# EAGLE board main (EAGLE 7.6.0)
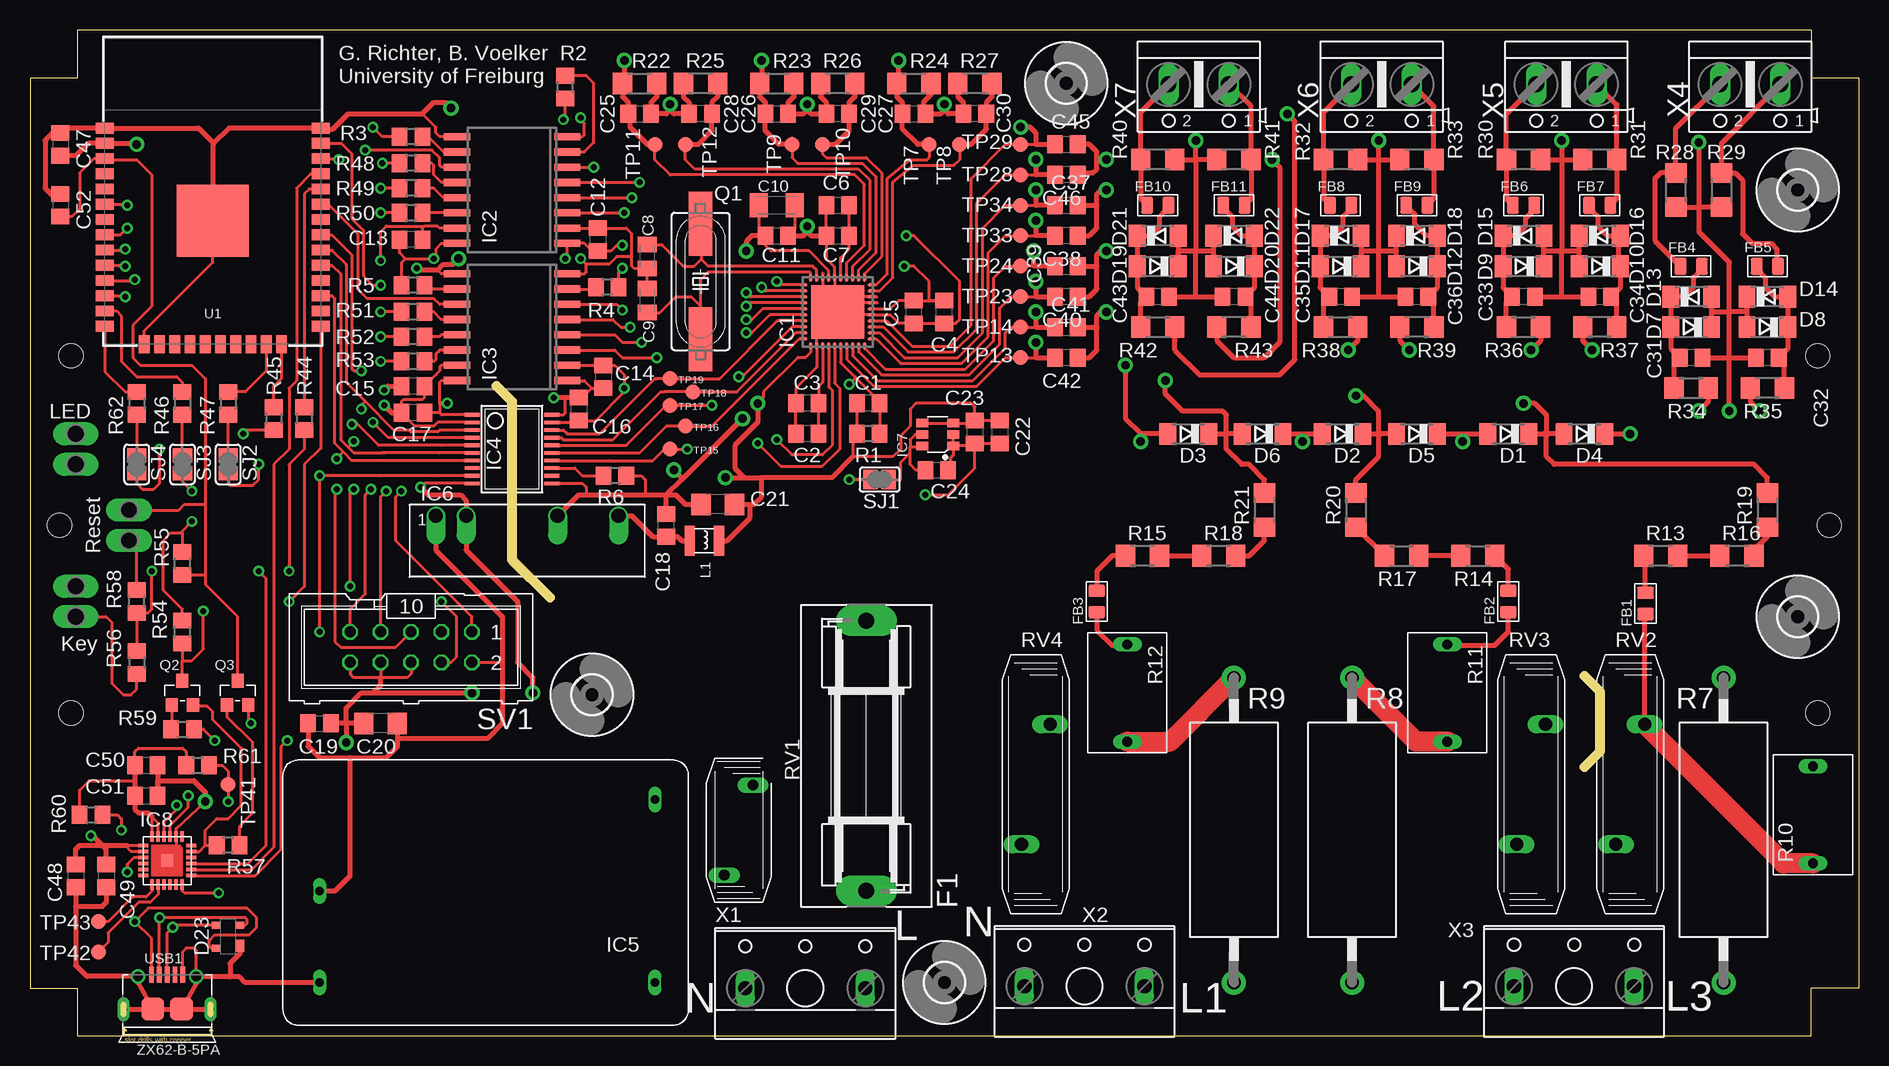
[diagram p7: board, top side]
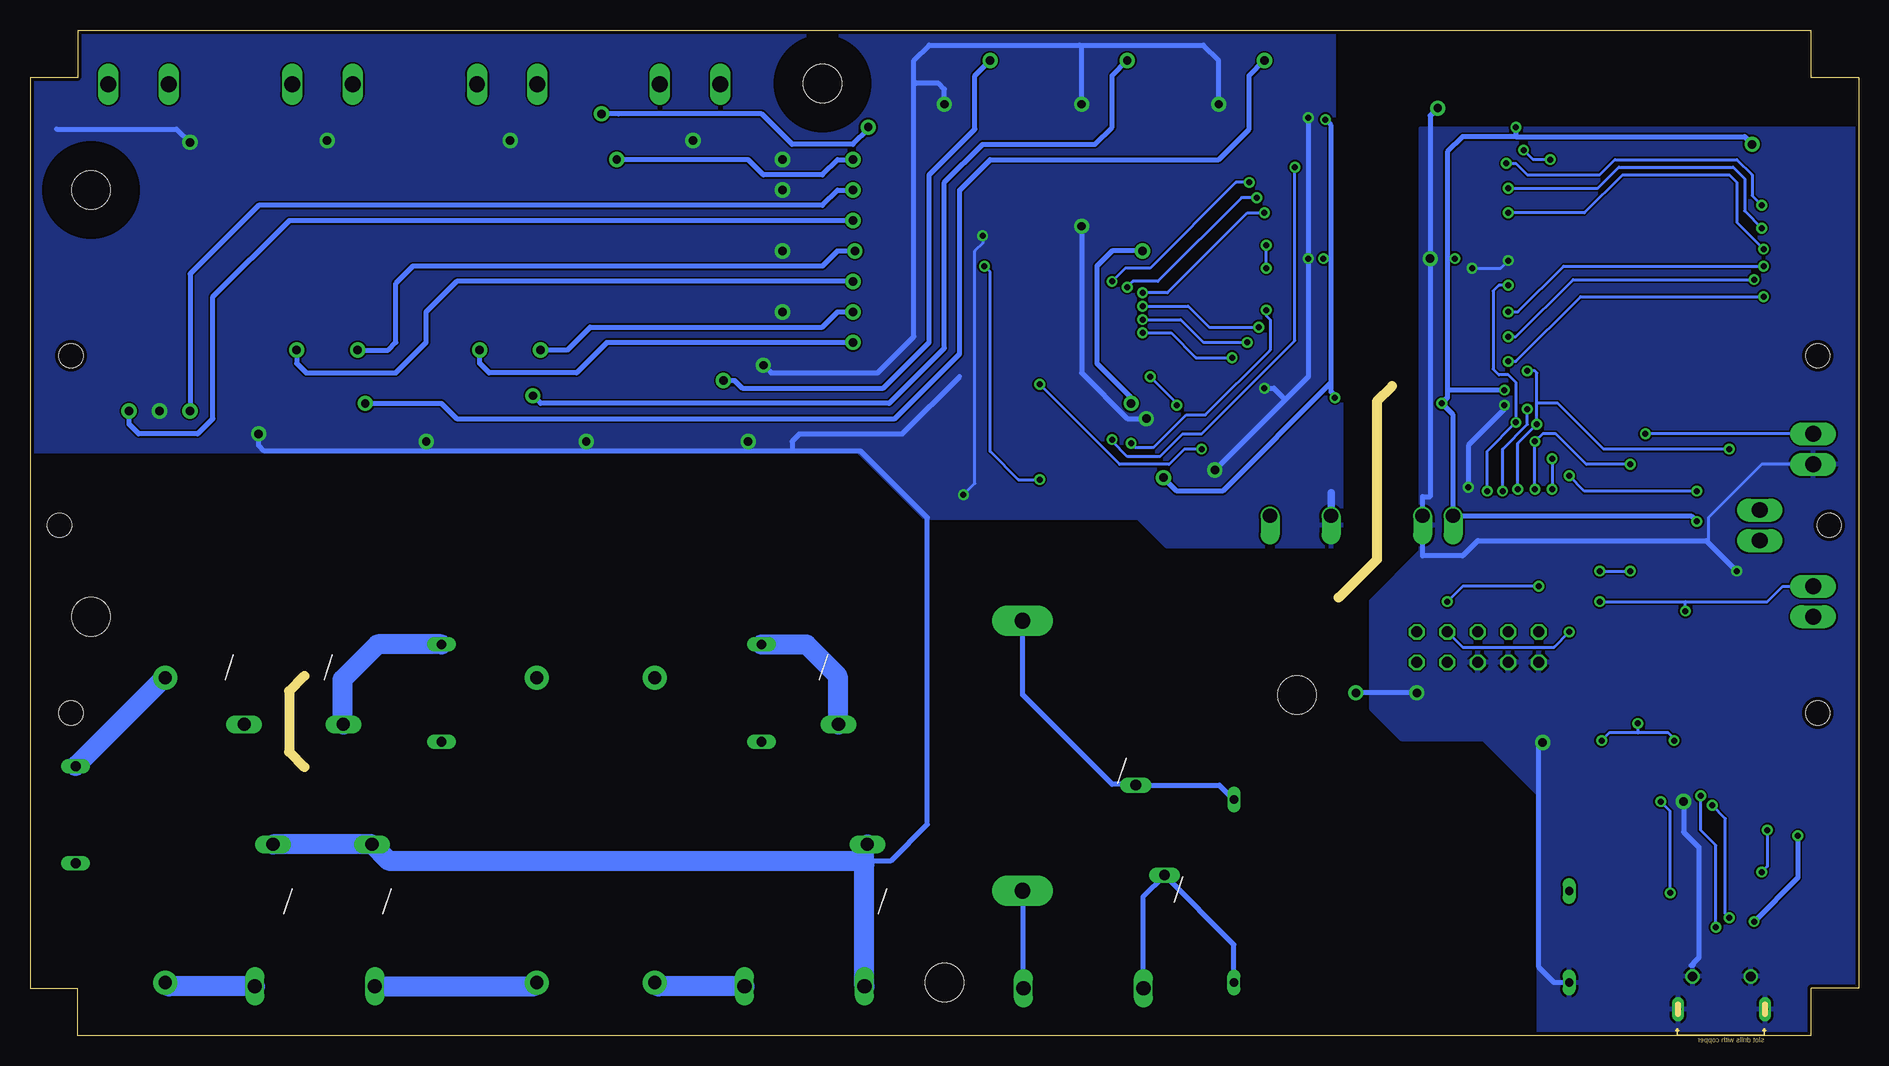
[diagram p8: board, bottom side, seen from below]

Size 152.4 x 83.82 mm. Coordinates in mm from the lower left corner, seen from the top.
Outline: 148.43,83.82 3.97,83.82 3.97,79.85 0,79.85 0,3.97 3.97,3.97 3.97,0 148.43,0 148.43,3.97 152.4,3.97 152.4,79.85 148.43,79.85 148.43,83.82
Copper layers (1*16): Top 0.035mm / dielectric 1.5mm / Bottom 0.035mm
Design rules "PCB-POOL Standard": minimum track width 0.15mm, minimum drill 0.3mm, track to track 0.15mm, track to pad 0.15mm, pad to pad 0.15mm, via to via 0.15mm, smd to smd 0.15mm, copper to edge 0.3mm, drill to drill 0.2mm, minimum pad ring 0.2mm, minimum via ring 0.15mm, stop-mask expansion 0.075mm, vias tented up to drill 0mil, thermal gap 0.2mm
Holes 2 mm at 148.99,56.67 148.99,26.91 3.41,56.67 2.46,42.55 3.41,26.91 149.94,42.55
Milling: 6 lines

## Footprints (pad centres in the part's own frame; a part is rotated, then mirrored left to right if it is on the bottom)
C0805 = smd 1.3 x 1.5: 1 -0.95,0; 2 0.95,0
C0805K = smd 1.3 x 1.6: 1 -1,0; 2 1,0
C1206K = smd 1.5 x 2: 1 -1.5,0; 2 1.5,0
C3216 = smd 1.6 x 1.8: 1 -1.4,0; 2 1.4,0
SOD80C = smd 1.4 x 1.8: A 1.7,0; C -1.7,0
SOT143-4-R = smd 1 x 0.7: 1 -0.75,-1 | smd 0.6 x 0.7: 2 0.95,-1; 3 0.95,1; 4 -0.95,1
SH22,5A = drill 1.321 pad 2.54 long: 1 -11.252,0; 2 11.252,0
L0805 = smd 1.016 x 1.397: 1 -0.889,0; 2 0.889,0
QFN40 = smd 0.65 x 0.25: 1 -2.825,2.25; 2 -2.825,1.75; 3 -2.825,1.25; 4 -2.825,0.75; 5 -2.825,0.25; 6 -2.825,-0.25; 7 -2.825,-0.75; 8 -2.825,-1.25; 9 -2.825,-1.75; 10 -2.825,-2.25; 21 2.825,-2.25; 22 2.825,-1.75; 23 2.825,-1.25; 24 2.825,-0.75; 25 2.825,-0.25; 26 2.825,0.25; 27 2.825,0.75; 28 2.825,1.25; 29 2.825,1.75; 30 2.825,2.25 | smd 0.25 x 0.65: 11 -2.25,-2.825; 12 -1.75,-2.825; 13 -1.25,-2.825; 14 -0.75,-2.825; 15 -0.25,-2.825; 16 0.25,-2.825; 17 0.75,-2.825; 18 1.25,-2.825; 19 1.75,-2.825; 20 2.25,-2.825; 31 2.25,2.825; 32 1.75,2.825; 33 1.25,2.825; 34 0.75,2.825; 35 0.25,2.825; 36 -0.25,2.825; 37 -0.75,2.825; 38 -1.25,2.825; 39 -1.75,2.825; 40 -2.25,2.825 | smd 4.45 x 4.45: EXP 0,0
SO16W = smd 0.6 x 2.2: 1 -4.445,-5.4; 2 -3.175,-5.4; 3 -1.905,-5.4; 4 -0.635,-5.4; 5 0.635,-5.4; 6 1.905,-5.4; 7 3.175,-5.4; 8 4.445,-5.4; 9 4.445,3.8; 10 3.175,3.8; 11 1.905,3.8; 12 0.635,3.8; 13 -0.635,3.8; 14 -1.905,3.8; 15 -3.175,3.8; 16 -4.445,3.8
SSOP20 = smd 0.305 x 1.245: 1 -2.857,-3.302; 2 -2.222,-3.302; 3 -1.587,-3.302; 4 -0.952,-3.302; 5 -0.317,-3.302; 6 0.318,-3.302; 7 0.953,-3.302; 8 1.588,-3.302; 9 2.223,-3.302; 10 2.858,-3.302; 11 2.858,3.302; 12 2.223,3.302; 13 1.588,3.302; 14 0.953,3.302; 15 0.318,3.302; 16 -0.317,3.302; 17 -0.952,3.302; 18 -1.587,3.302; 19 -2.222,3.302; 20 -2.857,3.302
MW_IRM-02 = drill 0.7 long: +V 13.97,0; -V 13.97,7.62; AC/L -13.97,-7.62; AC/N -13.97,7.62
SIP-7PIN-1257 = drill 1.2 offset: 1 -7.62,1.27; 2 -5.08,1.27; 5 2.54,1.27; 7 7.62,1.27
SOT-23-6 = smd 0.69 x 1: 1 -1.005,-1.065; 2 -0.055,-1.065; 3 0.895,-1.065; 4 0.895,1.535; 5 -0.055,1.535; 6 -1.005,1.535
QFN24 = smd 0.85 x 0.3: 1 -2,1.25; 2 -2,0.75; 3 -2,0.25; 4 -2,-0.25; 5 -2,-0.75; 6 -2,-1.25; 13 2,-1.25; 14 2,-0.75; 15 2,-0.25; 16 2,0.25; 17 2,0.75; 18 2,1.25 | smd 0.3 x 0.85: 7 -1.25,-2; 8 -0.75,-2; 9 -0.25,-2; 10 0.25,-2; 11 0.75,-2; 12 1.25,-2; 19 1.25,2; 20 0.75,2; 21 0.25,2; 22 -0.25,2; 23 -0.75,2; 24 -1.25,2 | smd 1.02 x 1.02: PAD 0,0
L1008 = smd 0.85 x 2.5: 1 -1.225,0; 2 1.225,0
HC49UP = smd 5.334 x 1.93: 1 -4.826,0; 2 4.826,0
SOT-23 = smd 1.016 x 1.143: 1 -0.889,-1.016; 2 0.889,-1.016; 3 0,1.016
R0805 = smd 1.3 x 1.5: 1 -0.95,0; 2 0.95,0
AC05 = drill 1.1 pad 2: 1 -12.7,0; 2 12.7,0
PTCCL10H010SBE = drill 0.813 long: 1 -4.04,0; 2 4.06,0
R1206 = smd 1.6 x 1.803: 1 -1.422,0; 2 1.422,0
TDK_E7.5_A2.4_W12.0_TH5.4_H15.0_D0.8 = drill 0.9 long: 1 1.2,3.75; 2 -1.2,-3.75
TDK_E10.0_A2.4_W21.5_TH5.6_H25.5_D1.0 = drill 1.1 long: 1 1.2,5; 2 -1.2,-5
SJ = smd 1.168 x 1.6: 1 -0.762,0; 2 0.762,0
ML10 = drill 0.914 octagon: 1 -5.08,-1.27; 2 -5.08,1.27; 3 -2.54,-1.27; 4 -2.54,1.27; 5 0,-1.27; 6 0,1.27; 7 2.54,-1.27; 8 2.54,1.27; 9 5.08,-1.27; 10 5.08,1.27
B1,27 = smd 1.27 x 1.27: TP 0,0
P1-13Y = drill 1.321 pad 1.905 long: TP 0,0
ESP-WROOM-03 = smd 0.9 x 1.5: 1 7.7,9; 2 6.43,9; 3 5.16,9; 4 3.89,9; 5 2.62,9; 6 1.35,9; 7 0.08,9; 8 -1.19,9; 9 -2.46,9; 10 -3.73,9; 11 -5,9; 12 -6.27,9; 13 -7.54,9; 14 -8.81,9; 25 -8.81,-9; 26 -7.54,-9; 27 -6.27,-9; 28 -5,-9; 29 -3.73,-9; 30 -2.46,-9; 31 -1.19,-9; 32 0.08,-9; 33 1.35,-9; 34 2.62,-9; 35 3.89,-9; 36 5.16,-9; 37 6.43,-9; 38 7.7,-9 | smd 1.5 x 0.9: 15 -10.3,5.715; 16 -10.3,4.445; 17 -10.3,3.175; 18 -10.3,1.905; 19 -10.3,0.635; 20 -10.3,-0.635; 21 -10.3,-1.905; 22 -10.3,-3.175; 23 -10.3,-4.445; 24 -10.3,-5.715 | smd 6 x 6: GND 0,0
3,2 = hole 3.2: 0,0
MICRO-USB5+6P-SMD-0.65-AB = smd 0.4 x 1.35: 1 -1.3,2.875; 2 -0.65,2.875; 3 0,2.875; 4 0.65,2.875; 5 1.3,2.875 | smd 1.9 x 1.9: P1 -1.2,0; P2 1.2,0 | drill 0.508 pad 1.016 long: P3 -3.625,0; P4 3.625,0 | drill 0.8: P5 -2.425,2.73; P6 2.425,2.73
W237-113 = drill 1.194 long: 1 -5,-1.27; 2 5,-1.27
AK500/2 = drill 1.321 long: 1 -2.515,0; 2 2.515,0

## Placement (x,y rotation side)
C1  1u  [C0805]  69.85,52.7 180 top
C2  4.7u  [C0805]  64.77,50.16 180 top
C3  100n  [C0805]  64.77,52.7 180 top
C4  4.7u  [C0805]  76.2,60.32 90 top
C5  100n  [C0805]  73.66,60.32 90 top
C6  4.7u  [C0805]  67.31,69.22 0 top
C7  100n  [C0805]  67.31,66.68 0 top
C8  16P  [C0805K]  51.43,64.93 270 top
C9  16P  [C0805K]  51.43,61.28 90 top
C10  10u  [C1206K]  62.23,69.22 0 top
C11  100n  [C0805]  62.23,66.68 0 top
C12  100n  [C0805]  47.31,66.36 270 top
C13  100n  [C0805]  31.75,66.36 180 top
C14  100n  [C0805]  47.78,54.93 270 top
C15  100n  [C0805]  31.91,54.13 180 top
C16  100n  [C0805]  45.72,52.23 270 top
C17  100n  [C0805]  31.91,51.91 180 top
C18  100n  [C0805]  53.02,42.55 90 top
C19  100n  [C0805]  24.13,26.04 0 top
C20  47uF  [C3216]  29.21,26.04 180 top
C21  6.8uF  [C3216]  57.31,44.29 180 top
C22  1u  [C0805]  80.8,50.32 270 top
C23  100n  [C0805]  78.74,50.32 270 top
C24  100n  [C0805]  75.56,47.15 0 top
C25  22n  [C0805]  50.8,76.84 0 top
C26  22n  [C0805]  62.23,76.84 0 top
C27  22n  [C0805]  73.66,76.84 0 top
C28  22n  [C0805]  55.88,76.84 180 top
C29  22n  [C0805]  67.31,76.84 180 top
C30  22n  [C0805]  78.74,76.84 180 top
C31  22n  [C0805]  138.43,56.52 180 top
C32  22n  [C0805]  144.78,56.52 180 top
C33  22n  [C0805]  124.46,61.6 180 top
C34  22n  [C0805]  130.81,61.6 180 top
C35  22n  [C0805]  109.22,61.6 180 top
C36  22n  [C0805]  115.57,61.6 180 top
C37  22n  [C0805]  86.36,69.22 0 top
C38  22n  [C0805]  86.36,66.68 180 top
C39  22n  [C0805]  86.36,64.13 0 top
C40  22n  [C0805]  86.36,61.6 180 top
C41  22n  [C0805]  86.36,59.05 0 top
C42  22n  [C0805]  86.36,56.52 180 top
C43  22n  [C0805]  93.98,61.6 180 top
C44  22n  [C0805]  100.33,61.6 180 top
C45  22n  [C0805]  86.36,74.29 0 top
C46  22n  [C0805]  86.36,71.75 180 top
C47  100n  [C0805]  2.54,74.29 270 top
C48  4.7u  [C0805]  3.81,13.34 270 top
C49  100n  [C0805]  6.35,13.34 270 top
C50  4.7u  [C0805]  9.68,22.54 0 top
C51  100n  [C0805]  9.68,20 0 top
C52  100n  [C0805]  2.54,69.22 270 top
D1  LL4148  [SOD80C]  123.19,50.16 180 top
D2  LL4148  [SOD80C]  109.38,50.16 180 top
D3  LL4148  [SOD80C]  96.52,50.16 180 top
D4  LL4148  [SOD80C]  129.54,50.16 180 top
D5  LL4148  [SOD80C]  115.57,50.16 180 top
D6  LL4148  [SOD80C]  102.71,50.16 180 top
D7  LL4148  [SOD80C]  138.43,59.05 180 top
D8  LL4148  [SOD80C]  144.78,59.05 180 top
D9  LL4148  [SOD80C]  124.46,64.13 180 top
D10  LL4148  [SOD80C]  130.81,64.13 180 top
D11  LL4148  [SOD80C]  109.22,64.13 180 top
D12  LL4148  [SOD80C]  115.57,64.13 180 top
D13  LL4148  [SOD80C]  138.43,61.6 0 top
D14  LL4148  [SOD80C]  144.78,61.6 0 top
D15  LL4148  [SOD80C]  124.46,66.68 0 top
D16  LL4148  [SOD80C]  130.81,66.68 0 top
D17  LL4148  [SOD80C]  109.22,66.68 0 top
D18  LL4148  [SOD80C]  115.57,66.68 0 top
D19  LL4148  [SOD80C]  93.98,64.13 180 top
D20  LL4148  [SOD80C]  100.33,64.13 180 top
D21  LL4148  [SOD80C]  93.98,66.68 0 top
D22  LL4148  [SOD80C]  100.33,66.68 0 top
D23  SP0503BAHTG  [SOT143-4-R]  16.51,8.25 90 top
F1  0.2A  [SH22,5A]  69.69,23.34 90 top
FB1  1k5  [L0805]  134.62,36.04 90 top
FB2  1k5  [L0805]  123.19,36.2 90 top
FB3  1k5  [L0805]  88.9,36.2 90 top
FB4  1k5  [L0805]  138.43,64.13 0 top
FB5  1k5  [L0805]  144.78,64.13 180 top
FB6  1k5  [L0805]  124.46,69.22 0 top
FB7  1k5  [L0805]  130.81,69.22 180 top
FB8  1k5  [L0805]  109.22,69.22 0 top
FB9  1k5  [L0805]  115.57,69.22 180 top
FB10  1k5  [L0805]  93.98,69.22 0 top
FB11  1k5  [L0805]  100.33,69.22 180 top
IC1  ADE9000  [QFN40]  67.31,60.32 90 top
IC2  ADUM3401CRWZ  [SO16W]  39.37,70.49 90 top
IC3  ADUM3401CRWZ  [SO16W]  39.37,59.05 90 top
IC4  ADUM3150ARSZ  [SSOP20]  40.16,48.9 270 top
IC5  IRM-02-3.3  [MW_IRM-02]  38.1,12.07 180 top
IC6  MURATA-PS-MEF1SXXXXSP3C  [SIP-7PIN-1257]  41.43,42.07 0 top
IC7  ADR3412  [SOT-23-6]  75.88,50.16 90 top
IC8  CP2102N-QFN24  [QFN24]  11.43,14.61 270 top
L1  330uH 0.1A  [L1008]  56.2,41.27 0 top
Q1  24.576MHz  [HC49UP]  55.88,62.87 270 top
Q2  S8050  [SOT-23]  12.7,28.58 0 top
Q3  S8050  [SOT-23]  17.3,28.58 0 top
R1  10k  [R0805]  69.85,50.16 180 top
R2  10k  [R0805]  44.61,79.06 90 top
R3  10k  [R0805]  31.75,74.93 180 top
R4  10k  [R0805]  48.1,62.39 180 top
R5  10k  [R0805]  31.91,62.55 180 top
R6  10k  [R0805]  48.74,46.67 180 top
R7  3k3 5W HSR  [AC05]  141.13,17.14 90 top
R8  3k3 5W HSR  [AC05]  110.17,17.14 90 top
R9  3k3 5W HSR  [AC05]  100.33,17.14 90 top
R10  400  [PTCCL10H010SBE]  148.59,18.41 90 top
R11  400  [PTCCL10H010SBE]  118.11,28.58 270 top
R12  400  [PTCCL10H010SBE]  91.44,28.58 270 top
R13  330k  [R1206]  135.89,40.01 0 top
R14  330k  [R1206]  120.65,40.01 180 top
R15  330k  [R1206]  92.71,40.01 0 top
R16  330k  [R1206]  142.24,40.01 0 top
R17  330k  [R1206]  114.3,40.01 180 top
R18  330k  [R1206]  99.06,40.01 0 top
R19  330k  [R1206]  144.78,43.81 90 top
R20  330k  [R1206]  110.49,43.81 90 top
R21  330k  [R1206]  102.87,43.81 90 top
R22  1k  [R1206]  50.8,79.38 180 top
R23  1k  [R1206]  62.23,79.38 180 top
R24  1k  [R1206]  73.66,79.38 180 top
R25  1k  [R1206]  55.88,79.38 0 top
R26  1k  [R1206]  67.31,79.38 0 top
R27  1k  [R1206]  78.74,79.38 0 top
R28  7.87  [R1206]  137.16,70.49 270 top
R29  7.87  [R1206]  140.97,70.49 90 top
R30  7.87  [R1206]  124.46,73.03 0 top
R31  7.87  [R1206]  130.81,73.03 0 top
R32  7.87  [R1206]  109.22,73.03 0 top
R33  7.87  [R1206]  115.57,73.03 0 top
R34  1k  [R1206]  138.43,53.98 180 top
R35  1k  [R1206]  144.78,53.98 0 top
R36  1k  [R1206]  124.46,59.05 180 top
R37  1k  [R1206]  130.81,59.05 0 top
R38  1k  [R1206]  109.22,59.05 180 top
R39  1k  [R1206]  115.57,59.05 0 top
R40  7.87  [R1206]  93.98,73.03 0 top
R41  7.87  [R1206]  100.33,73.03 0 top
R42  1k  [R1206]  93.98,59.05 180 top
R43  1k  [R1206]  100.33,59.05 0 top
R44  470  [R0805]  22.86,51.44 270 top
R45  470  [R0805]  20.32,51.44 270 top
R46  470  [R0805]  12.7,52.7 270 top
R47  470  [R0805]  16.51,52.7 270 top
R48  470  [R0805]  31.75,72.71 180 top
R49  470  [R0805]  31.75,70.64 180 top
R50  470  [R0805]  31.75,68.58 180 top
R51  470  [R0805]  31.91,60.32 180 top
R52  470  [R0805]  31.91,58.26 180 top
R53  470  [R0805]  31.91,56.2 180 top
R54  12k  [R0805]  12.7,33.66 90 top
R55  12k  [R0805]  12.7,39.37 90 top
R56  470  [R0805]  8.89,31.12 270 top
R57  12k  [R0805]  16.51,15.88 180 top
R58  470  [R0805]  8.89,36.2 90 top
R59  12k  [R0805]  12.7,25.56 0 top
R60  1k  [R0805]  5.08,18.41 0 top
R61  10k  [R0805]  13.97,22.54 0 top
R62  470  [R0805]  8.89,52.7 270 top
RV1  [TDK_E7.5_A2.4_W12.0_TH5.4_H15.0_D0.8]  59.05,17.14 180 top
RV2  300VAC  [TDK_E10.0_A2.4_W21.5_TH5.6_H25.5_D1.0]  133.35,20.95 180 top
RV3  300VAC  [TDK_E10.0_A2.4_W21.5_TH5.6_H25.5_D1.0]  125.09,20.95 180 top
RV4  300VAC  [TDK_E10.0_A2.4_W21.5_TH5.6_H25.5_D1.0]  83.82,20.95 180 top
SJ1  REF_ON  [SJ]  70.8,46.35 180 top
SJ2  HSPI_CS  [SJ]  16.51,47.62 270 top
SJ3  HSPI_DCLK  [SJ]  12.7,47.62 270 top
SJ4  HSPI_DCLK  [SJ]  8.89,47.62 270 top
SV1  EXT SPI  [ML10]  31.75,32.38 180 top
TP7  TPB1,27  [B1,27]  74.93,74.29 0 top
TP8  TPB1,27  [B1,27]  77.47,74.29 0 top
TP9  TPB1,27  [B1,27]  63.5,74.29 0 top
TP10  TPB1,27  [B1,27]  66.04,74.29 0 top
TP11  TPB1,27  [B1,27]  52.07,74.29 0 top
TP12  TPB1,27  [B1,27]  54.61,74.29 0 top
TP13  TPB1,27  [B1,27]  82.55,56.52 0 top
TP14  TPB1,27  [B1,27]  82.55,59.05 0 top
TP15  TPB1,27  [B1,27]  53.34,48.9 0 top
TP16  TPB1,27  [B1,27]  54.61,50.8 0 top
TP17  TPB1,27  [B1,27]  53.34,52.55 0 top
TP18  TPB1,27  [B1,27]  55.24,53.66 0 top
TP19  TPB1,27  [B1,27]  53.34,54.77 0 top
TP23  TPB1,27  [B1,27]  82.55,61.6 0 top
TP24  TPB1,27  [B1,27]  82.55,64.13 0 top
TP28  TPB1,27  [B1,27]  82.55,71.75 0 top
TP29  TPB1,27  [B1,27]  82.55,74.29 0 top
TP33  TPB1,27  [B1,27]  82.55,66.68 0 top
TP34  TPB1,27  [B1,27]  82.55,69.22 0 top
TP38  TPPAD1-13Y  [P1-13Y]  3.81,37.46 90 top
TP39  TPPAD1-13Y  [P1-13Y]  8.25,43.81 90 top
TP40  TPPAD1-13Y  [P1-13Y]  3.81,34.92 90 top
TP41  TPB1,27  [B1,27]  16.51,20.95 270 top
TP42  TPB1,27  [B1,27]  5.71,6.98 270 top
TP43  TPB1,27  [B1,27]  5.71,9.53 270 top
TP44  TPPAD1-13Y  [P1-13Y]  3.81,50.16 90 top
TP45  TPPAD1-13Y  [P1-13Y]  3.81,47.62 90 top
TP46  TPPAD1-13Y  [P1-13Y]  8.25,41.27 90 top
U1  ESP-WROOM-03  [ESP-WROOM-03]  15.24,67.94 90 top
U$1  [3,2]  76.2,4.45 0 top
U$2  [3,2]  86.36,79.38 0 top
U$3  [3,2]  147.32,34.92 0 top
U$4  [3,2]  147.32,70.49 0 top
U$5  [3,2]  46.83,28.42 0 top
USB1  ZX62-B-5PA  [MICRO-USB5+6P-SMD-0.65-AB]  11.43,2.22 0 top
X1  230V IN  [W237-113]  64.61,5.24 0 top
X2  [W237-113]  87.87,5.4 0 top
X3  [W237-113]  128.67,5.4 0 top
X4  ISENS_C  [AK500/2]  143.35,79.3 180 top
X5  ISENS_B  [AK500/2]  128.03,79.3 180 top
X6  ISENS_A  [AK500/2]  112.63,79.3 180 top
X7  ISENS_N  [AK500/2]  97.39,79.3 180 top

## Tracks (layer width: path | path; a pad name or v marks a point on that pad's centre or on a via)
230V_L
  Bottom 0.406: X1.2 69.61,12 F1.1
230V_N
  Bottom 0.406: X1.1 59.61,11.64 RV1.1 52.07,7.61 IC5.AC/N
!IRQ0
  Top 0.254: IC2.12 34.29,71.12 33.66,71.75 33.66,72.55 33.5,72.71 R48.1
!IRQ0!_ADE9000  (via drill 0.5)
  Top 0.254: IC1.31 62.52,62.57 v62.23,62.87 | IC2.5 v50.8,71.12
  Bottom 0.254: v62.23,62.87 61.12,63.98 59.05,63.98 51.91,71.12 v50.8,71.12
!IRQ1
  Top 0.254: IC2.13 34.45,69.85 33.66,70.64 R49.1
!IRQ1!_ADE9000  (via drill 0.5)
  Top 0.254: IC1.32 61.27,62.07 v60.96,62.39 | IC2.4 v50.16,69.85
  Bottom 0.254: v60.96,62.39 60.48,62.87 58.42,62.87 51.43,69.85 v50.16,69.85
!RESET  (via drill 0.5)
  Top 0.254: U1.27 25.16,61.68 25.4,61.44 25.4,49.37 26.11,48.66 | IC4.7 33.97,47.94 26.83,47.94 26.11,48.66 | v25.56,48.1 26.11,48.66 | v25.56,45.56 25.4,45.4 25.4,32.86 25.88,32.38 30.48,32.38 SV1.5
  Bottom 0.254: v25.56,48.1 v25.56,45.56
!RESET!_ADE9000  (via drill 0.5)
  Top 0.254: IC1.6 67.56,56.11 68.74,54.93 | 70.64,52.86 C1.1 | IC4.14 48.26,47.94 | 48.26,47.94 | C1.1 R1.1 | 48.26,47.94 51.91,47.94 52.86,48.9 TP15.TP v54.77,48.9 | 68.74,54.93 70.48,53.18 70.48,53.02 C1.1 | 68.74,54.93 68.74,54.77 v68.26,54.29
  Bottom 0.254: v54.77,48.9 56.2,48.9 57.47,47.62 61.59,47.62 v68.26,54.29
+3.3V/1  (via drill 0.5, 0.7)
  Top 0.254: 31.27,64.77 30.8,65.24 C13.2 | IC2.16 34.77,66.04 | 34.77,66.04 34.61,66.04 | R5.2 30.96,64.46 31.27,64.77 | IC3.16 34.29,54.61 34.13,54.45 34.13,52.7 | 31.11,53.98 C15.2 | IC4.1 34.29,51.75 34.13,51.91 | 34.13,51.91 C17.1 | C47.2 | 34.61,66.04 34.29,66.04 33.81,65.56 33.81,64.93 v33.66,64.77 31.27,64.77 | 34.61,66.04 34.77,65.88 34.77,66.04 | 8.81,74.38 v8.89,74.29 | R3.2 29.37,74.93 v28.57,75.72 | v34.77,52.7 34.13,52.7 | 34.13,52.7 34.13,51.91 | SV1.2 39.37,31.12 | R54.2 12.7,35.56 11.11,37.15 11.11,41.27 11.75,41.91 12.7,41.91 | 12.7,41.91 R55.2 | 12.7,41.91 12.7,42.07 v13.49,42.86
  Top 0.406: C47.2 3.81,73.34 4.84,74.38 U1.2 8.81,74.38 | v29.53,53.82 29.85,54.13 C15.2 | IC6.1 33.81,40.48 39.37,34.92 39.37,31.12 39.37,26.04 38.1,24.77 30.61,24.77 | IC5.+V 25.4,12.07 26.67,13.34 26.67,23.18 | C19.1 23.18,24.13 24.13,23.18 26.67,23.18 | 26.67,23.18 29.69,23.18 30.61,24.1 30.61,24.77 | C20.1 30.61,24.77
  Bottom 0.254: 34.13,53.82 34.29,53.82
  Bottom 0.406: v33.66,64.77 34.29,64.77 | 34.29,64.77 34.29,53.82 34.29,53.18 v34.77,52.7 33.81,51.75 IC6.1 13.97,43.34 v13.49,42.86 | 34.29,64.77 34.29,73.66 33.02,74.93 28.57,74.93 | v8.89,74.29 9.53,74.93 28.57,74.93 | v28.57,75.72 28.57,74.93 | v29.53,53.82 34.13,53.82
+3.3V/2  (via drill 0.5, 0.7)
  Top 0.254: IC1.1 65.06,56.96 64.61,56.52 63.98,56.52 61.12,53.66 61.12,53.18 v60.64,52.7 | IC1.27 66.56,63.77 64.93,65.41 61.75,65.41 61.28,65.88 C11.1 | C10.1 60.73,67.22 C11.1 | 44.45,51.75 IC4.20 43.62,51.75 44.45,51.75 | 44.45,51.75 | C16.1 46.03,53.18 46.83,53.98 | IC3.1 46.2,54.61 46.83,53.98 | 46.83,53.98 C14.2 | IC7.3 IC7.4 78.74,51.06 C23.1 | C1.2 R1.2 68.58,49.84 68.58,48.26 71.91,48.26 72.55,48.9 72.55,50.01 73.34,50.8 73.34,52.23 73.82,52.7 78.42,52.7 78.74,52.39 C23.1 | 44.45,51.75 44.61,51.91 44.61,53.18 | v44.45,76.36 44.61,76.52 R2.1 | v44.61,64.77 44.77,64.93 IC2.1 46.2,66.04 46.83,65.41 C12.2 48.42,65.41 48.89,65.88 v49.37,65.88 | R4.1 49.05,63.66 v49.37,63.98 | 60.96,66.68 C11.1 | C22.1 C23.1
  Top 0.406: 60.96,66.68 60.17,66.68 59.69,66.2 v59.69,65.41 | 60.96,46.51 66.83,46.51 68.58,48.26 | C21.1 60.01,44.29 | 60.01,44.29 60.33,44.29 60.96,44.93 60.96,46.51 | L1.2 58.1,41.27 60.01,43.18 60.01,44.29 | C16.1 44.61,53.18 v43.66,53.18 | v60.64,52.7 60.64,51.12 58.74,49.21 58.74,47.31 59.53,46.51 | 59.53,46.51 60.96,46.51 | v57.94,46.51 59.53,46.51
  Bottom 0.254: v49.37,63.98 v49.37,65.88
  Bottom 0.406: v59.69,65.41 62.23,65.41 63.5,64.13 63.5,56.04 60.64,53.18 v60.64,52.7 | 43.97,54.45 43.97,53.66 43.66,53.34 v43.66,53.18 | 43.97,54.45 43.97,64.77 | 43.97,64.77 43.97,75.88 v44.45,76.36 | v44.61,64.77 43.97,64.77 | 43.97,54.45 53.02,45.4 56.83,45.4 v57.94,46.51
CF1
  Top 0.254: IC2.14 R50.1
CF1_ADE9000  (via drill 0.5)
  Top 0.254: IC1.33 60.03,61.57 v59.69,61.91 | IC2.3 v49.53,68.58
  Bottom 0.254: v59.69,61.91 57.63,61.91 50.96,68.58 v49.53,68.58
CF2
  Top 0.254: IC3.12 34.29,59.69 33.66,60.32 R51.1
CF2_ADE9000  (via drill 0.5)
  Top 0.254: IC1.34 59.96,61.07 v59.69,60.8 | IC3.5 48.58,59.69 49.21,59.05 v50.01,59.05
  Bottom 0.254: v59.69,60.8 55.88,60.8 54.13,59.05 v50.01,59.05
CF3
  Top 0.254: IC3.13 34.29,58.42 34.13,58.26 R52.1
CF3_ADE9000  (via drill 0.5)
  Top 0.254: IC1.35 61.05,60.57 60.17,59.69 v59.69,59.69 | IC3.4 48.74,58.42 49.37,57.78 v50.96,57.78
  Bottom 0.254: v59.69,59.69 56.52,59.69 54.61,57.78 v50.96,57.78
CF4
  Top 0.254: IC3.14 34.13,57.15 33.81,56.83 33.81,56.36 33.66,56.2 R53.1
CF4_ADE9000  (via drill 0.5)
  Top 0.254: IC1.36 61.66,60.07 60.17,58.58 v59.69,58.58 | IC3.3 48.74,57.15 49.37,56.52 v52.23,56.52
  Bottom 0.254: v59.69,58.58 57.31,58.58 55.24,56.52 v52.23,56.52
CP2102_3.3V
  Top 0.254: IC8.6 10.18,18.24 10.68,17.74 IC8.5 | C50.1 8.73,23.65 9.05,23.97 12.7,23.97 13.02,23.65 R61.1 | R60.1 4.13,20.48 4.92,21.27 8.57,21.27 8.73,21.43
  Top 0.406: 10.18,18.24 9.84,18.57 9.05,18.57 8.73,18.89 C51.1 8.73,21.43 C50.1
DTR
  Top 0.254: IC8.23 14.08,15.36 14.6,15.88 | 14.6,15.88 R57.2 | 14.6,15.88 14.6,17.14 15.56,18.1 16.51,18.1 17.62,19.21 17.62,23.97 15.24,26.35 15.24,26.99 14.76,27.46 13.68,27.46 Q2.2
EN
  Top 0.254: C52.2 3.49,68.26 4.13,68.9 4.13,71.91 5.32,73.1 U1.3 6.35,73.1 6.35,73.03 8.89,73.03 10.16,71.75 10.16,60.8 8.57,59.21 8.57,56.52 9.21,55.88 13.49,55.88 14.6,54.77 14.6,44.29 | 14.6,44.29 14.6,38.42 | R55.1 14.6,38.42 | 14.6,38.42 14.6,37.62 17.3,34.92 Q3.3 | TP39.TP 12.38,43.81 12.86,44.29 14.6,44.29
GND1  (via drill 0.5, 0.7)
  Top 0.254: IC2.9 34.13,74.93 33.81,75.25 33.81,75.72 32.7,76.84 | 24.32,75.56 U1.38 | IC3.15 34.29,55.88 34.13,55.72 34.13,55.4 33.81,55.09 C15.1 32.86,53.18 32.7,53.02 31.11,53.02 30.96,52.86 C17.2 32.07,50.8 33.66,50.8 33.97,51.12 IC4.2 | 32.86,67.47 29.69,67.47 29.21,66.99 v29.21,64.61 | IC2.15 34.13,67.31 33.97,67.47 32.86,67.47 | 32.86,67.47 32.7,67.31 C13.1 | 15.32,74.37 15.24,74.29 | IC4.10 33.81,46.04 | 33.81,46.04 | 2.94,75.65 C47.1 1.9,75.25 | 1.9,70.01 2.38,70.01 C52.1 | IC3.9 34.29,63.5 33.97,63.82 | USB1.5 12.73,7.02 13.02,7.3 13.65,7.3 13.85,7.1 USB1.P6 | v14.6,19.53 12.18,17.26 IC8.2 12.18,14.65 12.22,14.61 IC8.PAD | U1.15 9.53,58.74 15.24,64.45 15.24,68.74 | 33.81,46.04 32.86,46.04 v32.54,45.72 | R56.1 R58.1 9.84,35.24 10.16,35.56 v10.16,38.73 | SV1.6 31.75,30.16 31.43,29.84 29.21,29.84 | 29.21,29.84 26.99,29.84 26.67,30.16 SV1.10 | SV1.8 29.21,29.84
  Top 0.406: U1.38 16.59,75.65 15.32,74.37 14.05,75.65 U1.1 2.94,75.65 | 15.24,74.29 15.24,68.74 U1.GND | 1.9,75.25 1.27,74.61 1.27,70.64 1.9,70.01 | 24.32,75.56 25.24,75.56 26.51,76.84 32.7,76.84 33.66,77.79 34.61,77.79 v35.08,77.31 | v32.23,63.98 32.38,63.82 33.97,63.82 34.45,64.29 35.24,64.29 v35.72,64.77 | USB1.P3 USB1.P1 | USB1.P2 USB1.P4 | USB1.P1 9,4.4 USB1.P5 4.73,4.95 3.81,5.87 3.81,10.79 | USB1.P6 13.85,4.4 USB1.P2 | USB1.P1 USB1.P2 | v29.53,52.55 30.16,51.91 C17.2 | v32.54,45.72 33.18,45.09 35.88,45.09 36.35,44.61 IC6.2 36.35,40.48 40.64,36.2 40.64,31.12 41.91,29.84 v41.91,28.58 | D23.1 17.51,6.87 16.67,6.03 16.67,4.92 | IC5.-V 17.94,4.45 17.46,4.92 16.67,4.92 | 26.35,26.04 C19.2 | C20.2 26.35,26.04 | 26.35,26.04 26.35,27.3 27.62,28.58 28.57,28.58 | 28.57,28.58 29.21,29.21 29.21,29.84 | 28.57,28.58 v36.83,28.58 | 26.35,26.04 v26.35,24.45 | 3.49,12.07 C48.2 3.81,10.79 | C50.2 C51.2 10.63,21.27 10.64,21.27 13.65,21.27 14.6,20.32 v14.6,19.53 | C49.2 6.35,11.11 6.03,10.79 3.81,10.79 | 16.67,4.92 13.81,4.92
  Bottom 0.254: v32.23,63.98 29.85,63.98 v29.21,64.61 | TP45.TP 8.1,47.62 12.54,43.18 12.54,41.27 12.7,41.27
  Bottom 0.406: v35.08,77.31 35.72,76.68 35.72,44.93 36.35,44.93 IC6.2 36.35,41.91 | v29.53,52.55 29.53,52.23 32.54,49.21 v32.54,45.72 | 36.35,41.91 36.2,41.27 | IC5.-V 25.4,4.45 26.67,5.71 26.67,24.13 v26.35,24.45 | v36.83,28.58 v41.91,28.58 | v14.6,19.53 14.6,16.99 13.33,15.72 13.33,6.51 13.81,6.03 13.81,5.87 13.97,5.87 | v10.16,38.73 12.7,41.27 31.75,41.27 33.02,40.01 36.35,40.01 36.35,41.91
  pour Bottom: -1.27,75.56 36.51,75.56 36.51,40.32 40.64,36.2 40.64,27.3 38.1,24.77 31.27,24.77 26.67,20.16 26.67,-0.95 -1.43,-0.95
GND2  (via drill 0.5, 0.7)
  Top 0.254: C2.2 C3.2 63.82,53.98 65.56,55.72 IC1.2 65.56,58.58 IC1.EXP | C6.1 C7.1 66.36,64.77 67.06,64.07 IC1.26 67.06,61.12 | C10.2 63.73,67.22 C11.2 | IC1.28 66.06,62.09 66.04,62.07 66.04,61.6 IC1.EXP | IC1.28 66.06,61.57 IC1.EXP | 67.06,61.12 67.06,60.57 IC1.EXP | IC1.EXP 68.58,61.6 68.9,61.6 68.92,61.57 IC1.18 70.57,61.57 | 67.06,61.12 67.1,61.07 IC1.17 70.61,61.07 | IC1.EXP 67.56,60.07 IC1.15 71.69,60.07 72.39,59.38 C5.1 C4.1 77.16,59.38 77.47,59.69 77.47,62.87 73.66,66.68 v73.02,66.68 | IC2.2 47.62,67.31 C12.1 49.69,67.31 50.16,66.83 50.16,64.93 | C9.2 C8.2 50.37,63.93 50.16,64.13 50.16,64.93 | IC4.19 45.56,51.12 C16.2 47.15,51.28 49.53,53.66 v49.53,53.98 49.53,55.09 48.74,55.88 C14.1 IC3.2 | IC7.1 77,49.21 78.74,49.21 C23.2 | IC7.1 IC7.2 | IC7.1 76.95,48.37 76.68,48.1 76.68,47.31 C24.2 | v74.61,45.09 76.52,45.09 78.74,47.31 C23.2 | 95.68,63.98 D19.C | IC3.8 46.2,63.5 46.35,63.66 46.35,64.29 | R6.1 50.96,46.67 51.28,46.35 51.28,45.09 | IC4.11 46.04,46.04 46.35,45.72 46.35,45.24 46.51,45.09 | IC2.8 46.04,74.93 46.2,75.09 46.2,76.04 45.88,76.36 v45.88,76.52 | 50.16,64.93 48.89,64.93 48.26,64.29 46.35,64.29 | 46.35,64.29 v45.88,64.77 | 66.06,63.58 66.06,63.11 | C23.2 C22.2 | 66.06,63.11 | 66.06,63.11 IC1.28
  Top 0.406: 140.13,58.94 D7.C D13.A 140.13,60.37 140.18,60.32 141.6,60.32 | 143.03,61.6 D14.C 143.08,60.32 | C46.1 87.47,71.91 88.58,71.91 88.9,72.23 88.9,73.03 | R40.2 97.16,73.03 | D21.A D19.C | 95.68,63.98 95.68,65.36 95.73,65.41 97.16,65.41 | 97.16,65.41 97.31,65.41 | 97.31,65.41 98.63,65.41 | D20.A 98.63,65.41 | 98.63,65.41 D22.C | 97.16,61.6 C44.2 | R41.1 97.16,73.03 | 97.16,73.03 97.16,65.41 | 97.16,61.6 97.16,65.25 97.31,65.41 | C43.1 97.16,61.6 | 88.9,73.03 v89.69,73.03 | R32.2 112.39,73.03 | 112.39,73.03 R33.1 | D17.A D11.C 110.92,65.36 110.97,65.41 112.39,65.41 | D12.A 113.87,65.41 | 113.87,65.41 D18.C | 112.39,65.41 113.87,65.41 | C35.1 112.39,61.6 | 112.39,61.6 C36.2 | 112.39,61.6 112.39,65.41 | 112.39,65.41 112.39,73.03 | 112.39,73.03 v112.39,74.61 | 127.63,73.03 R31.1 | D9.C D15.A 126.16,65.45 126.21,65.41 127.63,65.41 | D10.A 129.11,65.41 | 129.11,65.41 D16.C | 127.63,65.41 129.11,65.41 | C33.1 127.63,61.6 | 127.63,61.6 C34.2 | v127.63,74.61 127.63,73.03 | 127.63,61.6 127.63,65.41 | R30.2 127.63,73.03 | 127.63,73.03 127.63,65.41 | 143.08,60.32 D8.A | C31.1 141.6,56.52 | 141.6,56.52 C32.2 | v141.6,52.07 141.6,56.52 | 141.6,56.52 141.6,60.32 | 143.08,60.32 141.6,60.32 | v64.77,67.47 64.77,66.99 | 64.77,66.99 65.09,66.68 C7.1 | C11.2 64.45,66.68 64.77,66.99 | IC6.5 45.72,45.09 46.51,45.09 51.28,45.09 53.02,45.09 | 53.02,45.09 53.82,45.09 54.61,44.29 C21.2 55.88,44.26 | v59.37,51.44 54.29,46.35 | 54.29,46.35 53.02,45.09 | C18.2 53.02,45.09 | v53.66,47.15 54.29,46.51 54.29,46.35 | 88.9,73.03 88.9,73.66 88.27,74.29 C45.2 | v139.06,74.45 139.06,69.06 | 141.6,60.32 141.6,64.45 139.06,66.99 139.06,69.06 | R24.1 75.08,78.42 74.45,77.79 74.45,76.99
  Top 0.406: 74.45,76.99 C27.2 | R27.1 77.32,78.26 77.79,77.79 C30.2 76.52,76.84 76.2,77.15 | R26.1 65.89,78.26 66.36,77.79 C29.2 | C29.2 65.09,76.84 64.77,77.15 | R23.1 63.65,78.26 63.18,77.79 C26.2 | C26.2 | R22.1 52.22,78.26 51.75,77.79 C25.2 53.02,76.84 53.34,77.15 | R25.1 54.46,78.26 54.93,77.79 C28.2 53.66,76.84 53.34,77.15 | C26.2 64.45,76.84 64.77,77.15 | C29.2 | 53.34,77.15 v53.34,77.63 | v64.77,77.63 64.77,77.15 | 74.45,76.99 C27.2 75.88,76.84 76.2,77.15 | 76.2,77.15 v76.2,77.63 | D6.C 106.05,50.16 | 106.05,50.16 D2.A | v106.05,49.53 106.05,50.16 | D4.C v133.35,50.16 | v91.28,55.88 91.28,51.44 92.55,50.16 | D3.A 92.55,50.16 | 92.55,50.16 v92.55,49.53 | 117,50.16 D5.C 119.38,50.16 | 119.38,50.16 D1.A | v119.38,49.53 119.38,50.16 | 97.16,73.03 v97.16,74.61 | C37.2 88.9,69.22 | 88.9,69.22 88.9,70.17 89.22,70.49 v89.69,70.49 | C38.1 88.27,66.68 88.9,67.31 88.9,69.22 | C39.2 88.9,64.13 | 88.9,64.13 88.9,65.09 89.22,65.41 v89.69,65.41 | C40.1 88.27,61.6 88.9,62.23 88.9,64.13 | C41.2 88.74,59.05 | 88.74,59.05 88.9,59.05 88.9,60.01 89.22,60.32 v89.69,60.32 | C42.1 88.27,56.52 88.9,57.15 88.9,58.9 88.74,59.05 | R29.1 139.06,69.06 | R28.2 139.06,69.06
  Bottom 0.254: v73.02,66.68 73.02,66.04 73.66,65.41 73.66,46.04 v74.61,45.09
  Bottom 0.406: v64.77,67.47 64.77,55.24 60.96,51.44 v59.37,51.44 | 47.78,53.02 45.88,54.93 v45.88,64.77 v45.88,76.52 | 47.78,53.02 v53.66,47.15 | v49.53,53.98 48.74,53.98 47.78,53.02 | 150.18,75.56 140.18,75.56 v139.06,74.45 | v53.34,77.63 53.34,81.28 54.61,82.55 64.93,82.55 | 82.87,14.61 80.64,14.61 77.63,17.62 77.63,43.18 83.19,48.74 88.9,48.74 | 88.9,48.74 92.55,48.74 | 92.55,48.74 106.05,48.74 | 106.05,48.74 119.38,48.74 | 119.38,48.74 132.87,48.74 133.35,49.21 v133.35,50.16 | 78.74,79.53 78.74,58.26 81.76,55.24 90.65,55.24 v91.28,55.88 | 78.74,79.53 78.74,81.28 77.47,82.55 64.93,82.55 | v64.77,77.63 64.77,82.39 64.93,82.55 | v76.2,77.63 76.2,78.9 76.68,79.38 78.58,79.38 78.74,79.53 | 74.93,54.93 79.69,50.16 88.27,50.16 88.9,49.53 88.9,48.74 | v92.55,49.53 92.55,48.74 | 106.05,48.74 v106.05,49.53 | 119.38,48.74 v119.38,49.53
  Bottom 0.61: IC6.5 43.97,45.24
  Bottom 1.676: 82.87,14.29 X2.1 | 82.87,14.29 82.87,14.61 82.87,15.88 RV4.1 | RV2.1 RV3.1 122.55,14.61 83.19,14.61 82.87,14.29
  pour Bottom: 43.81,85.88 43.81,53.18 43.18,53.18 43.18,40.8 57.63,40.8 60.01,43.18 77.79,43.18 83.34,48.74 154.78,48.74 154.94,48.58 154.94,85.72
HSPI_CS
  Top 0.254: U1.23 19.69,55.4 17.94,53.66 R47.1
HSPI_SCK
  Top 0.254: U1.13 7.22,60.4 7.62,60.01 7.62,56.2 8.89,54.93 12.22,54.93 12.7,54.45 R46.1
HSPI_SDI
  Top 0.254: U1.14 6.24,55.35 7.94,53.66 R62.1
IAN  (via drill 0.7)
  Top 0.254: IC1.8 68.56,56.69 70.64,54.61 78.58,54.61 81.28,57.31 81.28,58.58 81.76,59.05 TP14.TP 83.82,59.05
  Top 0.406: R38.1 110.64,57.94 v109.86,57.15 | 85.09,59.05 C41.1 83.82,59.05 v83.82,60.32
  Bottom 0.406: v83.82,60.32 85.09,60.32 86.36,59.05 105.73,59.05 107.63,57.15 v109.86,57.15
IAN_IN
  Top 0.406: X6.2 107.8,76.97 R32.1 107.8,69.75 FB8.1
IAP  (via drill 0.7)
  Top 0.254: IC1.7 68.06,56.4 70.33,54.13 78.9,54.13 81.28,56.52 TP13.TP 83.82,56.52
  Top 0.406: R39.1 114.15,57.94 v114.94,57.15 | 85.09,56.52 C42.2 83.82,56.52 v83.82,57.78
  Bottom 0.406: 85.09,57.78 v83.82,57.78 104.3,57.78 106.84,55.24 114.14,55.24 114.94,56.04 v114.94,57.15
IAP_IN
  Top 0.406: X6.1 116.99,77.45 R33.2 116.99,69.75 FB9.1
IBN  (via drill 0.7)
  Top 0.254: IC1.10 69.56,57.28 71.28,55.56 77.95,55.56 80.33,57.94 80.33,63.18 81.28,64.13 TP24.TP 83.66,64.13 | C39.1
  Top 0.406: R36.1 125.88,57.94 v125.09,57.15 | C39.1 84.93,64.13 | C39.1 83.66,64.13 v83.66,65.41
  Bottom 0.406: v125.09,57.15 122.55,57.15 121.92,57.78 121.92,62.71 120.49,64.13 86.36,64.13 85.09,65.41 v83.66,65.41
IBN_IN
  Top 0.406: X5.2 123.04,76.82 R30.1 123.04,69.75 FB6.1
IBP  (via drill 0.7)
  Top 0.254: IC1.9 69.06,56.99 70.96,55.09 78.26,55.09 80.8,57.63 80.8,60.64 81.76,61.6 TP23.TP 83.82,61.6
  Top 0.406: R37.1 129.39,57.94 v130.18,57.15 | 85.09,61.6 C40.2 83.82,61.6 v83.82,62.87
  Bottom 0.406: v130.18,57.15 130.18,56.04 129.38,55.24 121.92,55.24 119.38,57.78 119.38,60.32 116.84,62.87 v83.82,62.87
IBP_IN
  Top 0.406: X5.1 132.23,77.61 R31.2 132.23,69.75 FB7.1
ICN  (via drill 0.7)
  Top 0.254: IC1.12 70.81,58.58 72.87,56.52 77.31,56.52 79.38,58.58 79.38,67.31 81.28,69.22 TP34.TP 83.82,69.22
  Top 0.406: R34.1 139.85,52.86 v139.06,52.07 | 85.09,69.22 C37.1 83.82,69.22 v83.82,70.49
  Bottom 0.406: v83.82,70.49 85.09,70.49 86.36,69.22 133.35,69.22 139.06,63.5 v139.06,52.07
ICN_IN
  Top 0.406: 137.01,64.67 FB4.1 135.41,66.26 135.41,71.44 135.88,71.91 R28.1 137.16,75.62 X4.2
ICP  (via drill 0.7)
  Top 0.254: IC1.11 70.51,58.08 72.55,56.04 77.63,56.04 79.85,58.26 79.85,65.25 81.28,66.68 TP33.TP 83.82,66.68
  Top 0.406: R35.1 143.36,52.86 v144.15,52.07 | v83.82,67.94 83.82,66.68 C38.2
  Bottom 0.406: v144.15,52.07 144.15,50.96 143.35,50.16 138.43,50.16 137.16,51.44 137.16,61.6 130.81,67.94 v83.82,67.94
ICP_IN
  Top 0.406: 145.41,78.74 145.41,78.84 X4.1 140.97,74.4 R29.2 142.09,71.91 142.72,71.28 142.72,66.83 143.51,66.04 145.1,66.04 145.57,65.56 145.57,64.23 FB5.1
INN  (via drill 0.7)
  Top 0.254: IC1.14 71.39,59.57 73.5,57.47 76.68,57.47 78.42,59.21 78.42,71.44 81.28,74.29 TP29.TP 83.82,74.29
  Top 0.406: R42.1 95.4,58.42 | 95.4,58.42 95.4,57.94 | 95.4,58.42 95.41,58.41 95.41,57.15 97.47,55.09 104.14,55.09 105.41,56.36 105.41,76.2 v104.77,76.84 | v82.55,75.72 83.34,75.72 83.82,75.25 83.82,74.29 C45.1
  Bottom 0.406: 103.35,76.84 v104.77,76.84 91.44,76.84 88.9,74.29 83.82,74.29 82.55,75.56 v82.55,75.72
INN_IN
  Top 0.406: X7.2 92.56,76.97 R40.1 92.56,69.75 FB10.1
INP  (via drill 0.7)
  Top 0.254: IC1.13 71.1,59.08 73.18,56.99 76.99,56.99 78.9,58.9 78.9,69.37 81.28,71.75 TP28.TP 83.82,71.75
  Top 0.406: 85.09,71.75 C46.2 83.82,71.75 v83.82,73.03 | v103.5,73.03 104.14,72.39 104.14,57.78 102.87,56.52 100.33,56.52 98.9,57.94 R43.1
  Bottom 0.406: v83.82,73.03 85.09,73.03 86.36,71.75 91.28,71.75 92.55,73.03 v103.5,73.03
INP_IN
  Top 0.406: X7.1 101.75,77.45 R41.2 101.75,69.75 FB11.1
IO0  (via drill 0.5)
  Top 0.254: U1.25 24.24,48.94 24.18,48.94 22.86,47.62 22.86,37.46 v21.59,36.2 | Q2.3 12.7,31.27 | R54.1 12.7,31.27 | 12.7,31.27 13.49,31.27 14.45,32.23 v14.45,35.4
  Bottom 0.254: v21.59,36.2 14.45,36.2 | v14.45,35.4 14.45,36.2 | 14.45,36.2 7.62,36.2 6.35,37.46 TP38.TP
IO2  (via drill 0.5)
  Top 0.254: R45.2 18.1,50.48 v17.78,50.16
  Bottom 0.254: TP44.TP v17.78,50.16
MISO_ADE9000  (via drill 0.5)
  Top 0.254: IC1.38 63.52,59.08 59.37,54.93 v59.05,54.93 | IC4.16 48.26,49.21 49.69,49.21 53.02,52.55 | TP17.TP v56.83,52.55
  Top 0.406: 53.02,52.55 TP17.TP
  Bottom 0.254: v56.83,52.55 56.83,52.7 v59.05,54.93
MOSI_ADE9000
  Top 0.254: IC1.39 63.81,58.58 58.9,53.66 TP18.TP 52.86,53.66 52.55,53.66 48.58,49.69 44.45,49.69 44.29,49.85 IC4.17
N$1
  Top 1.676: R12.2 95,24.52 R9.2
N$2
  Top 0.406: FB3.1 88.9,33.81 90.17,32.54 91.28,32.54 91.44,32.7 R12.1
  Bottom 1.676: R12.1 87.7,32.62 85.09,30 85.09,26.02 RV4.2
N$3
  Top 0.254: R62.2 SJ4.1
N$4
  Top 0.406: R15.1 90.17,40.01 88.9,38.73 FB3.2
N$5
  Top 1.676: R11.2 115.5,24.52 R8.2
N$6
  Top 0.406: R11.1 118.11,32.54 122.08,32.54 123.19,33.66 FB2.1 123.19,35.4
  Bottom 1.676: R11.1 123.44,32.62 126.37,29.69 126.37,26.02 RV3.2
N$7
  Bottom 1.676: X3.2 140.81,4.13 R7.1
N$8
  Top 0.406: R15.2 R18.1
N$9
  Top 0.406: FB2.2 123.19,38.89 R14.1
N$10
  Top 0.406: R14.2 R17.1
N$11
  Top 0.406: R17.2 R20.1
N$12
  Top 0.406: R18.2 101.6,40.01 102.87,41.27 R21.1
N$13
  Top 0.254: C2.1 C3.1 65.72,53.18 65.72,54.13 66.06,54.47 IC1.3
N$14
  Bottom 1.676: R7.2 141.22,29.84 R10.2
N$15
  Top 0.406: RV2.2 134.55,35.08 FB1.1
  Top 1.676: R10.1 146.13,14.38 RV2.2
N$16
  Bottom 1.676: X3.1 110.49,4.13 R8.1
N$17
  Top 0.406: FB1.2 134.62,39.85 R13.1
N$18
  Top 0.406: R13.2 R16.1
N$19
  Top 0.406: R16.2 143.66,40.47 144.78,41.59 R19.1
N$20
  Top 0.406: IC6.7 50.16,43.34 51.91,41.59 C18.1 53.97,41.59 54.29,41.27 L1.1
N$21
  Top 0.254: IC1.25 67.56,64.86 68.26,65.56 C7.2 C6.2
N$22
  Top 0.406: FB6.2 125.35,68.83 124.62,68.1 124.62,67.47 123.83,66.68 D15.C D9.A 122.76,62.35 C33.2 123.04,61.12 R36.2
N$23
  Bottom 0.406: IC5.AC/L 53.28,20.89 RV1.2 60.31,20.95 62.23,20.95 69.69,28.42 F1.2
N$24
  Top 0.406: FB10.2 94.61,68.96 94.61,68.74 94.14,68.26 94.14,67.47 93.34,66.68 D21.C D19.A 92.28,62.35 C43.2 92.56,61.12 R42.2
N$25
  Top 0.406: FB4.2 139.32,63.91 138.59,63.18 138.59,62.39 137.79,61.6 D13.C D7.A 136.73,57.27 C31.2 137.01,56.04 R34.2
N$26
  Top 0.254: U1.34 23.26,70.56 22.86,70.17 R44.1
N$27
  Top 0.254: IC2.10 34.45,73.66 33.34,74.77 32.86,74.77 R3.1
N$28
  Top 0.406: FB8.2 110.11,68.99 109.38,68.26 109.38,67.47 108.58,66.68 D17.C D11.A 107.52,62.35 C35.2 107.8,61.12 R38.2
N$29
  Top 0.254: IC4.13 45.4,47.31 46.04,46.67 R6.2
N$30
  Top 0.254: IC1.29 65.56,63.82 65.25,64.13 56.52,64.13 55.94,64.71 | Q1.1 55.94,67.31 55.94,64.71 | 55.94,64.71 55.37,64.13 54.45,64.13 52.66,65.93 C8.1
N$31
  Top 0.254: IC1.30 65.06,63.53 64.93,63.66 56.52,63.66 55.88,63.02 55.88,60.8 | 55.94,57.78 Q1.2 55.88,60.8 | 55.88,60.8 55.09,61.6 53.82,61.6 52.5,60.28 C9.1
N$32
  Top 0.254: IC3.7 46.99,62.23 R4.2
N$33
  Top 0.254: IC3.10 33.18,62.23 R5.1
N$35
  Top 0.254: IC2.7 46.2,73.66 46.99,74.45 46.99,79.38 46.35,80.01 45.88,80.01 R2.2
N$36
  Top 0.254: IC7.6 74.24,49.05 73.34,49.05 | IC7.5 73.76,50.11 73.34,49.69 73.34,49.05 | SJ1.1 72.55,46.35 72.55,47.78 73.34,48.58 | C24.1 73.82,47.15 73.34,47.62 73.34,48.58 | 73.34,48.58 73.34,49.05
N$38
  Top 0.254: R45.1 20.32,54.13 20.96,54.77 U1.24 21.11,57.49
N$39
  Top 0.254: R57.1 17.46,17.14 17.46,17.46 18.57,18.57 18.57,24.45 16.42,26.61 Q3.1
N$40
  Top 0.254: Q2.1 11.81,25.62 R59.1
N$41
  Top 0.254: TP40.TP 6.35,34.92 6.83,34.45 6.83,29.37 7.78,28.42 8.41,28.42 8.89,28.89 R56.2
N$42
  Top 0.254: R58.2 8.89,40.64 TP46.TP
N$44  (via drill 0.5)
  Top 0.254: IC8.18 12.68,12.09 12.86,11.91 v15.72,11.91 | v16.51,19.53 TP41.TP 16.51,22.07 16.03,22.54 R61.2
  Bottom 0.254: v15.72,11.91 15.72,18.73 v16.51,19.53
N$45  (via drill 0.5)
  Top 0.254: IC8.9 8.66,14.86 8.1,14.29 v8.1,13.65 | R60.2 7.3,18.41 7.62,18.1 v7.62,17.14
  Bottom 0.254: v7.62,17.14 7.62,14.13 v8.1,13.65
N$49
  Top 0.254: IC8.14 10.68,11.79 10,11.11 9.05,11.11 6.51,8.57 6.51,7.78 TP42.TP
N$50
  Top 0.254: IC8.13 10.18,12.09 9.68,11.59 8.57,11.59 6.51,9.53 TP43.TP
N$51
  Top 0.254: SJ3.1 R46.2
N$52
  Top 0.254: SJ2.1 R47.2
N$53
  Bottom 1.676: X2.2 100.01,4.13 R9.1
N$64  (via drill 0.5)
  Top 0.254: R48.2 v29.37,72.71 | U1.6 8.02,69.29 v8.1,69.22
  Bottom 0.254: v29.37,72.71 28.57,72.71 27.62,71.75 21.59,71.75 20.32,73.03 10.16,73.03 8.89,71.75 8.89,70.01 v8.1,69.22
N$65  (via drill 0.5)
  Top 0.254: R49.2 v29.21,70.64 | U1.8 7.54,66.75 v8.1,67.31
  Bottom 0.254: v29.21,70.64 21.75,70.64 20,72.39 10.48,72.39 9.53,71.44 9.53,68.74 v8.1,67.31
N$66  (via drill 0.5)
  Top 0.254: R50.2 v29.21,68.58 | U1.9 7.86,65.49 v7.94,65.56
  Bottom 0.254: v29.21,68.58 22.86,68.58 19.69,71.75 10.79,71.75 10.16,71.12 10.16,67.79 v7.94,65.56
N$67  (via drill 0.5)
  Top 0.254: R51.2 v29.21,60.32 | U1.10 7.86,64.22 v7.94,64.13
  Bottom 0.254: v29.21,60.32 28.42,60.32 24.61,64.13 v7.94,64.13
N$68  (via drill 0.5)
  Top 0.254: R52.2 v29.21,58.26 | U1.11 8.65,62.95 v8.73,63.02
  Bottom 0.254: v29.21,58.26 28.57,58.26 23.81,63.02 v8.73,63.02
N$69  (via drill 0.5)
  Top 0.254: R53.2 v29.21,56.2 | U1.12 7.86,61.68 v7.94,61.6
  Bottom 0.254: v29.21,56.2 28.57,56.2 23.18,61.6 v7.94,61.6
PM0_ADE9000  (via drill 0.5)
  Top 0.254: IC1.4 66.56,54.09 66.83,53.82 66.83,49.21 66.04,48.42 63.5,48.42 v62.23,49.69 | IC2.6 v46.99,72.39
  Bottom 0.254: v62.23,49.69 62.23,49.53 60.96,48.26 58.26,48.26 56.36,50.16 54.77,50.16 46.99,57.94 v46.99,72.39
PM1
  Top 0.254: U1.33 24.84,69.29 27.3,66.83 27.3,62.23 28.1,61.44 33.66,61.44 34.13,60.96 IC3.11
PM1_ADE9000  (via drill 0.5)
  Top 0.254: IC1.5 67.06,54.38 67.47,53.98 67.47,48.9 66.04,47.47 62.55,47.47 v60.64,49.37 | IC3.6 48.89,60.96 v49.37,60.48
  Bottom 0.254: v49.37,60.48 49.37,60.01 49.05,59.69 49.05,57.15 54.45,51.75 56.04,51.75 58.74,49.05 60.33,49.05 v60.64,49.37
PM2  (via drill 0.5)
  Top 0.254: IC2.11 34.29,72.39 34.13,72.55 34.13,73.18 33.5,73.82 v27.94,73.82 | U1.36 25.64,73.1 v25.72,73.03
  Bottom 0.254: v25.72,73.03 27.15,73.03 v27.94,73.82
REF  (via drill 0.5)
  Top 0.254: IC1.16 71.69,60.57 72.39,61.27 C5.2 C4.2 74.93,61.27 74.93,61.28 74.93,62.87 73.66,64.13 v72.87,64.13 | SJ1.2 v68.26,46.35
  Bottom 0.254: v72.87,64.13 72.39,63.66 72.39,48.7 SJ1.2 v68.26,46.35
RTS  (via drill 0.5)
  Top 0.254: IC8.19 18.75,13.36 20.96,15.56 20.96,24.13 v21.43,24.61 | R59.2 14.45,25.56 v15.4,24.61 | Q3.2 18.19,26.26 v18.42,26.04
  Bottom 0.254: v15.4,24.61 15.4,24.77 15.87,25.24 18.42,25.24 | 18.42,25.24 20.8,25.24 v21.43,24.61 | v18.42,26.04 18.42,25.24
RX_ESP32  (via drill 0.5)
  Top 0.254: R44.2 22.86,48.9 21.59,47.62 v21.59,38.73 | IC8.21 18.17,14.36 19.69,15.88 19.69,38.1 v19.05,38.73
  Bottom 0.254: v21.59,38.73 v19.05,38.73
SCLK_ADE9000
  Top 0.254: IC4.18 44.45,50.48 44.77,50.16 47.47,50.16 52.07,54.77 52.23,54.77 TP19.TP 57.47,54.77 62.27,59.57 IC1.37
SPI_DELAY  (via drill 0.5)
  Top 0.254: IC4.9 33.97,46.67 | 33.97,46.67 | 33.97,46.67 29.21,46.67 v24.13,46.67 v24.13,33.66 | SJ3.2 12.7,46.2 v13.49,45.4
  Bottom 0.254: SV1.3 33.02,32.38 25.4,32.38 v24.13,33.66 | v13.49,45.4 22.86,45.4 v24.13,46.67
SS_ADE9000
  Top 0.254: IC1.40 64.11,58.08 56.83,50.8 TP16.TP 53.02,50.8 50.8,48.58 48.1,48.58 IC4.15
TX_ESP32
  Top 0.254: U1.35 23.42,71.84 22.23,70.64 22.23,54.61 21.59,53.98 21.59,48.9 20.32,47.62 20.32,15.72 18.46,13.86 IC8.20
USB_D+  (via drill 0.5)
  Top 0.254: USB1.3 11.43,8.57 v11.91,9.05 12.06,9.21 D23.3 | IC8.3 11.68,17.55 13.18,19.05 v13.18,20
  Bottom 0.254: v11.91,9.05 11.91,15.88 13.18,17.14 v13.18,20
USB_D-  (via drill 0.5)
  Top 0.254: IC8.4 11.18,17.85 12.22,18.89 v12.22,19.21 | USB1.2 10.78,8.9 v10.79,9.84 17.94,9.84 18.1,9.68 18.1,9.37 17.94,9.21 D23.2
  Bottom 0.254: v10.79,9.84 11.11,10.16 11.11,18.1 v12.22,19.21
VAN
  Top 0.254: IC1.19 70.81,62.07 71.91,63.18 71.91,71.12 73.66,72.55 76.99,72.55 77.47,73.03 TP8.TP
  Top 0.406: R27.2 80.16,78.26 79.69,77.79 C30.1 79.69,75.56 78.42,74.29 TP8.TP
VAP  (via drill 0.7)
  Top 0.254: IC1.20 70.51,62.57 71.44,63.5 71.44,71.44 73.34,73.03 74.77,73.03 74.93,73.18 TP7.TP
  Top 0.406: R24.2 72.24,78.26 72.71,77.79 C27.1 72.71,75.56 73.98,74.29 TP7.TP | R21.2 102.87,46.35 101.6,47.62 100.97,47.62 99.69,48.9 99.69,50.16 | 99.69,50.16 99.69,51.75 99.38,52.07 96.04,52.07 94.61,53.5 v94.61,54.61 | D3.C 99.69,50.16 | D6.A 99.69,50.16 | 72.39,80.65 v72.39,81.28 72.39,79.38 R24.2 | R24.2
  Bottom 0.406: v72.39,81.28 73.66,80.01 73.66,75.56 77.47,71.75 77.47,57.78 81.28,53.98 93.03,53.98 93.66,54.61 v94.61,54.61
VBN
  Top 0.254: IC1.21 69.56,63.53 70.96,64.93 70.96,71.91 69.69,73.18 66.36,73.18 66.04,73.5 TP10.TP
  Top 0.406: R26.2 68.73,78.26 68.26,77.79 C29.1 68.26,75.41 67.15,74.29 TP10.TP
VBN1
  Top 0.406: FB9.2 115.41,68.49 115.41,67.63 116.36,66.68 D18.A D12.C 117.27,62.35 C36.1 116.99,61.12 R39.2
VBN2
  Top 0.406: FB7.2 129.92,68.99 130.65,68.26 130.65,67.47 131.44,66.68 D16.A 132.35,66.52 132.35,64.29 D10.C 132.51,62.35 C34.1 132.23,61.12 R37.2
VBN3
  Top 0.406: FB11.2 99.44,68.99 100.17,68.26 100.17,67.47 100.97,66.68 D22.A D20.C 102.03,62.35 C44.1 101.75,61.12 R43.2
VBN4
  Top 0.406: FB5.2 143.89,63.91 144.62,63.18 144.62,62.39 145.41,61.6 D14.A D8.C 146.48,57.27 C32.1 146.2,56.04 R35.2
VBP  (via drill 0.7)
  Top 0.254: IC1.22 69.06,63.82 70.48,65.25 70.48,71.6 69.37,72.71 63.98,72.71 63.5,73.18 TP9.TP
  Top 0.406: R20.2 110.49,46.35 112.39,48.26 112.39,50.01 | 112.39,50.01 112.39,50.16 | 112.39,50.16 112.39,52.07 111.12,53.34 v110.49,53.34 | D2.C 112.39,50.16 | D5.A 112.55,50.16 112.39,50.01 | v60.96,81.28 60.96,79.38 R23.2 60.81,78.26 61.28,77.79 C26.1 61.28,75.41 62.39,74.29 TP9.TP
  Bottom 0.406: v60.96,81.28 62.23,80.01 62.23,75.72 63.66,74.29 73.02,74.29 76.2,71.12 76.2,57.31 80.8,52.7 109.86,52.7 v110.49,53.34
VBUS  (via drill 0.5)
  Top 0.254: USB1.1 10.13,8.13 v8.73,9.53 9.84,10.64 18.1,10.64 18.89,9.84 18.89,9.05 18.26,8.41 15.4,8.41 14.92,7.94 14.92,7.46 15.08,7.3 D23.4 | IC8.7 8.12,15.86 8.1,15.88 | IC8.8 8.46,15.36 7.94,15.88
  Top 0.406: C48.1 3.81,15.56 4.13,15.88 6.03,15.88 | C49.1 6.35,15.56 6.03,15.88 | v5.08,16.67 5.24,16.67 6.03,15.88 | 6.03,15.88 7.94,15.88 8.1,15.88
  Bottom 0.406: v5.08,16.67 5.08,13.18 v8.73,9.53
VCN
  Top 0.254: IC1.23 68.56,64.12 70.01,65.56 70.01,71.28 69.06,72.23 55.4,72.23 54.61,73.03 TP12.TP
  Top 0.406: R25.2 57.3,78.26 56.83,77.79 C28.1 56.83,75.41 55.72,74.29 TP12.TP
VCP  (via drill 0.7)
  Top 0.254: IC1.24 68.06,64.41 69.53,65.88 69.53,70.96 68.74,71.75 53.34,71.75 52.07,73.03 TP11.TP
  Top 0.406: R19.2 144.78,46.51 143.67,47.62 127,47.62 126.37,48.26 126.37,50.01 | D4.A 126.52,50.16 126.37,50.01 | D1.C 126.21,50.16 | 126.21,50.16 126.37,50.01 | v124.46,52.7 125.41,52.7 126.37,51.75 126.37,50.32 126.21,50.16 | v49.53,81.28 49.53,79.53 R22.2 49.38,78.26 49.85,77.79 C25.1 50.01,76.84 50.01,75.72 51.43,74.29 TP11.TP
  Bottom 0.406: v124.46,52.7 118.11,52.7 116.84,51.44 80.33,51.44 74.93,56.83 74.93,70.49 72.39,73.03 53.34,73.03 50.8,75.56 50.8,80.01 v49.53,81.28
VSPI_CS  (via drill 0.5)
  Top 0.254: U1.29 25.16,64.22 25.88,63.5 25.88,49.69 26.51,49.05 | IC4.6 34.13,48.58 | 34.13,48.58 | 34.13,48.58 29.53,48.58 | 29.53,48.58 | 29.53,48.58 29.37,48.58 26.99,48.58 26.51,49.05 | v26.99,49.53 26.51,49.05 | SJ2.2 16.51,46.04 16.67,45.88 18.57,45.88 19.05,46.35 v19.05,47.62 | SV1.4 35.08,31.12 35.56,31.59 35.56,34.92 v34.29,36.2 | v26.67,37.46 26.67,45.24 v26.99,45.56
  Bottom 0.254: v19.05,47.62 22.7,47.62 25.24,50.16 26.35,50.16 v26.99,49.53 v26.99,45.56 | v26.67,37.46 33.02,37.46 v34.29,36.2
VSPI_SCK  (via drill 0.5)
  Top 0.254: U1.30 25.16,65.49 26.35,64.29 26.35,54.45 27.94,52.86 | IC4.3 34.13,50.48 33.97,50.32 31.75,50.32 31.59,50.48 30.32,50.48 27.94,52.86 | SV1.7 29.21,44.93 v29.69,45.4 | v27.62,52.23 27.62,52.55 27.94,52.86
  Bottom 0.254: v29.69,45.4 29.69,48.9 27.62,50.96 v27.62,52.23
VSPI_SDI  (via drill 0.5)
  Top 0.254: U1.31 25.16,66.75 26.83,65.09 26.83,55.56 26.99,55.4 v27.62,55.4 | IC4.5 34.29,49.21 | 34.29,49.21 | 34.29,49.21 29.05,49.21 27.3,50.96 v26.83,50.96 | SJ4.2 8.89,46.04 9.37,45.56 10.32,45.56 10.79,46.04 v10.79,48.9 | SV1.9 26.67,35.56 27.94,36.83 27.94,45.09 v28.42,45.56
  Bottom 0.254: 26.83,52.7 v26.83,50.96 28.42,49.37 v28.42,45.56 | 26.83,52.7 26.83,55.24 26.99,55.4 v27.62,55.4 | v10.79,48.9 21.27,48.9 25.08,52.7 26.83,52.7
VSPI_SDO  (via drill 0.5)
  Top 0.254: U1.37 25.96,74.38 26.83,73.5 26.83,68.1 27.78,67.15 27.78,63.34 28.57,62.55 v29.21,62.55 | SV1.1 36.83,34.92 30.48,41.27 30.48,44.93 v30.96,45.4 | v28.57,51.12 29.85,49.85 IC4.4
  Bottom 0.254: v29.21,62.55 30,62.55 30.48,62.07 30.48,55.56 30,55.09 29.21,55.09 28.57,54.45 v28.57,51.12 30.96,48.74 v30.96,45.4

## Text on the board
tNames: G. Richter, B. Voelker / University of Freiburg | LED | Reset | Key | N | L | L2 | L3 | N | L1